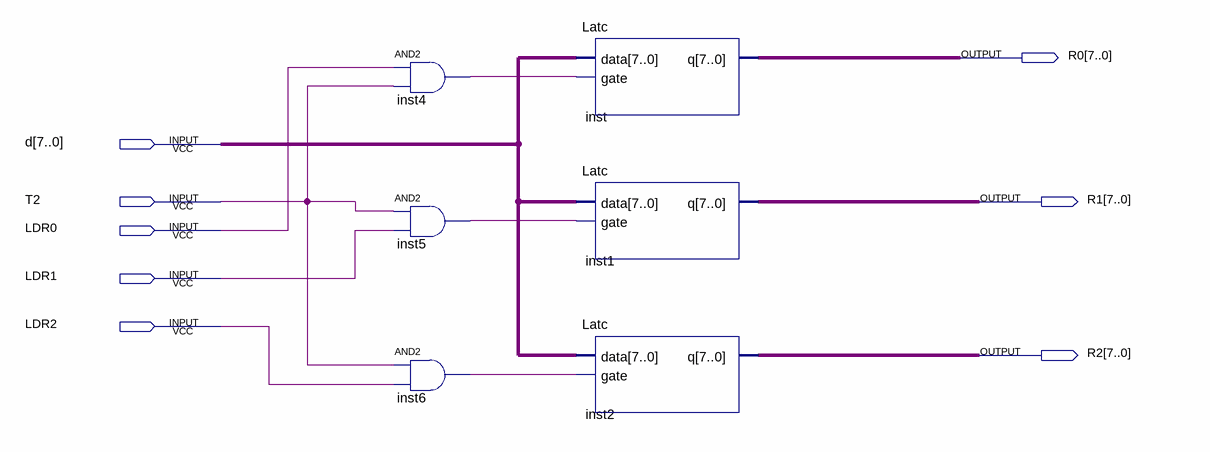
[diagram p0: schematic sheet]
// Quartus schematic reg0_2.bdf as structural Verilog: 6 symbols, 8 pins
module reg0_2 (
  input  [7:0] d,
  input  T2,
  input  LDR0,
  input  LDR1,
  input  LDR2,
  output [7:0] R0,
  output [7:0] R1,
  output [7:0] R2
);

  wire inst4_out, inst5_out, inst6_out;

  and inst4 (inst4_out, LDR0, T2);
  and inst5 (inst5_out, T2, LDR1);
  and inst6 (inst6_out, T2, LDR2);
  Latc inst (.data(d), .gate(inst4_out), .q(R0));
  Latc inst1 (.data(d), .gate(inst5_out), .q(R1));
  Latc inst2 (.data(d), .gate(inst6_out), .q(R2));
endmodule
